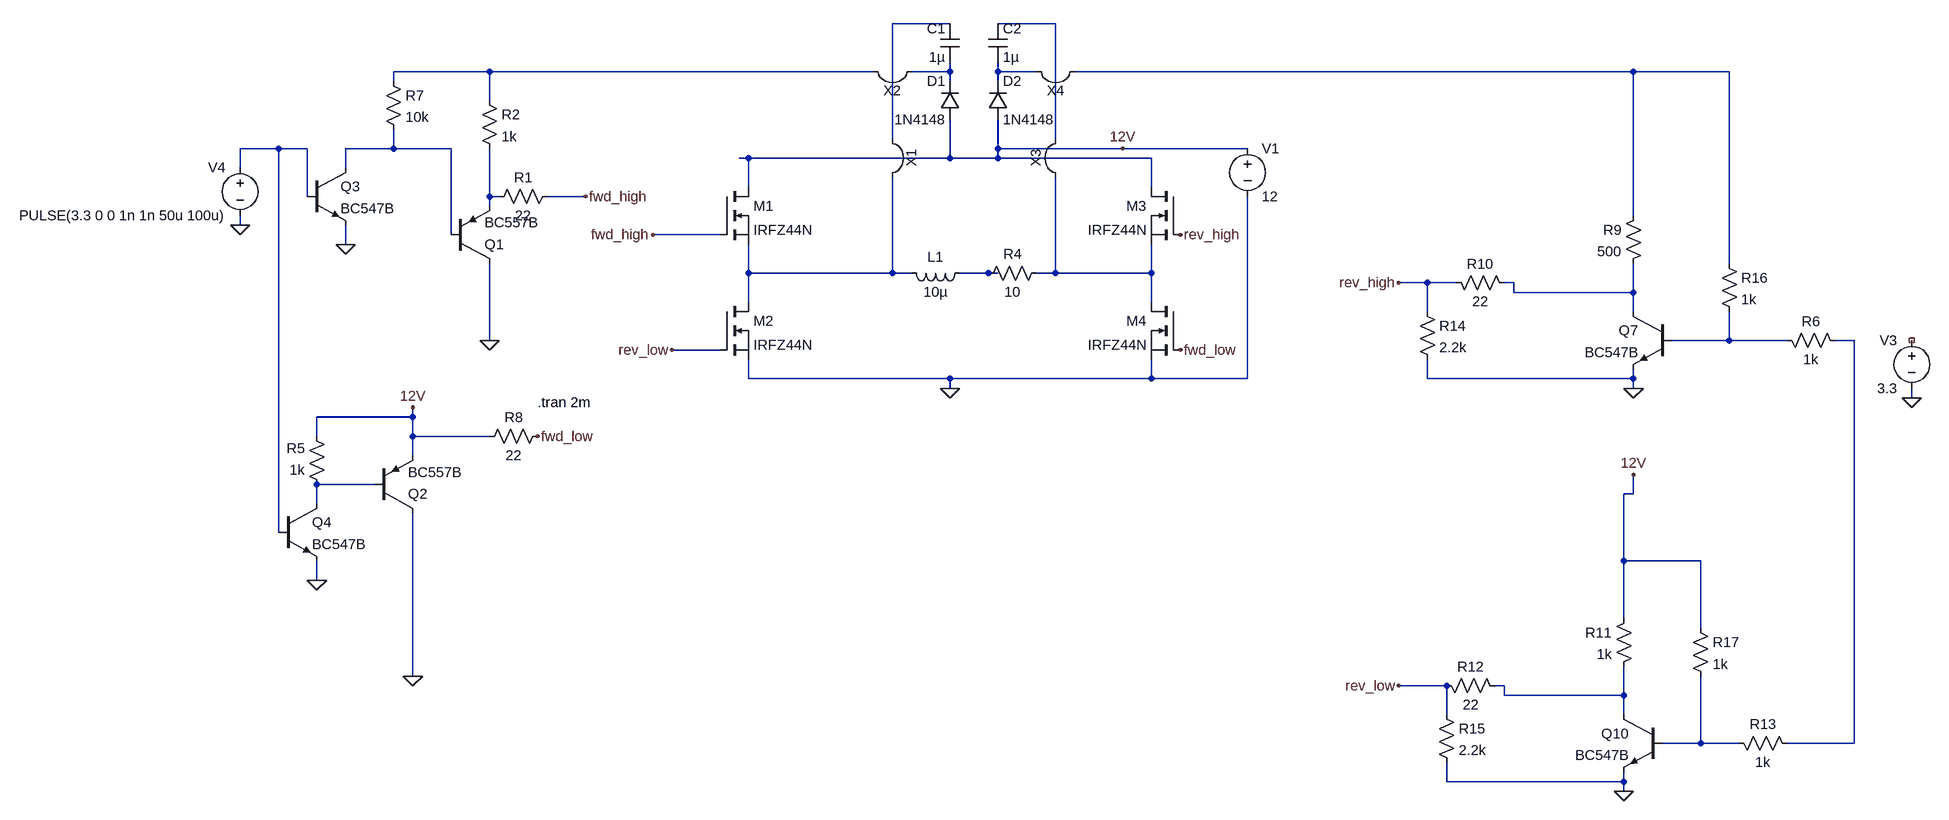
[diagram p0: schematic h-bridge-minimal-pnp-drive.asc]
h-bridge-minimal-pnp-drive.asc, the LTspice schematic file:
Version 4
SHEET 1 2020 1140
WIRE 224 -272 128 -272
WIRE 400 -272 304 -272
WIRE -672 -192 -832 -192
WIRE 96 -192 -672 -192
WIRE 224 -192 224 -208
WIRE 224 -192 160 -192
WIRE 304 -192 304 -208
WIRE 368 -192 304 -192
WIRE 1520 -192 432 -192
WIRE 1680 -192 1520 -192
WIRE -832 -176 -832 -192
WIRE 224 -176 224 -192
WIRE 304 -176 304 -192
WIRE -672 -144 -672 -192
WIRE 128 -80 128 -272
WIRE 400 -80 400 -272
WIRE -1024 -64 -1088 -64
WIRE -976 -64 -1024 -64
WIRE -832 -64 -832 -96
WIRE -832 -64 -912 -64
WIRE -736 -64 -832 -64
WIRE 304 -64 304 -112
WIRE 512 -64 304 -64
WIRE 720 -64 512 -64
WIRE -240 -48 -256 -48
WIRE 224 -48 224 -112
WIRE 224 -48 -240 -48
WIRE 304 -48 304 -64
WIRE 304 -48 224 -48
WIRE 560 -48 304 -48
WIRE -1088 -32 -1088 -64
WIRE -912 -32 -912 -64
WIRE -240 0 -240 -48
WIRE 560 0 560 -48
WIRE -976 16 -976 -64
WIRE -672 16 -672 -64
WIRE -656 16 -672 16
WIRE -512 16 -576 16
WIRE -672 32 -672 16
WIRE 1520 48 1520 -192
WIRE -1088 64 -1088 48
WIRE -736 80 -736 -64
WIRE -288 80 -400 80
WIRE -912 96 -912 64
WIRE 1680 128 1680 -192
WIRE -240 144 -240 96
WIRE 128 144 128 -16
WIRE 128 144 -240 144
WIRE 160 144 128 144
WIRE 288 144 240 144
WIRE 304 144 288 144
WIRE 400 144 400 -16
WIRE 400 144 368 144
WIRE 560 144 560 96
WIRE 560 144 400 144
WIRE 1120 160 1072 160
WIRE 1168 160 1120 160
WIRE 1264 160 1248 160
WIRE 1264 176 1264 160
WIRE 1520 176 1520 128
WIRE 1520 176 1264 176
WIRE -240 192 -240 144
WIRE 560 192 560 144
WIRE 1120 208 1120 160
WIRE 1520 208 1520 176
WIRE -672 256 -672 128
WIRE 1680 256 1680 208
WIRE 1680 256 1584 256
WIRE 1776 256 1680 256
WIRE 1888 256 1856 256
WIRE -288 272 -368 272
WIRE -240 320 -240 288
WIRE 224 320 -240 320
WIRE 560 320 560 288
WIRE 560 320 224 320
WIRE 720 320 720 16
WIRE 720 320 560 320
WIRE 1120 320 1120 288
WIRE 1520 320 1520 304
WIRE 1520 320 1120 320
WIRE 224 336 224 320
WIRE 1520 336 1520 320
WIRE 1984 352 1984 336
WIRE -800 384 -800 368
WIRE -800 384 -960 384
WIRE -960 416 -960 384
WIRE -800 416 -800 384
WIRE -672 416 -800 416
WIRE -800 448 -800 416
WIRE -864 496 -960 496
WIRE 1520 512 1520 480
WIRE 1520 512 1504 512
WIRE -960 528 -960 496
WIRE -1024 576 -1024 -64
WIRE 1504 624 1504 512
WIRE 1632 624 1504 624
WIRE -960 656 -960 624
WIRE 1504 720 1504 624
WIRE 1632 736 1632 624
WIRE -800 816 -800 544
WIRE 1152 832 1072 832
WIRE 1248 832 1232 832
WIRE 1248 848 1248 832
WIRE 1504 848 1504 800
WIRE 1504 848 1248 848
WIRE 1152 880 1152 832
WIRE 1504 880 1504 848
WIRE 1632 928 1632 816
WIRE 1632 928 1568 928
WIRE 1696 928 1632 928
WIRE 1888 928 1888 256
WIRE 1888 928 1776 928
WIRE 1152 992 1152 960
WIRE 1504 992 1504 976
WIRE 1504 992 1152 992
WIRE 1504 1008 1504 992
FLAG 224 336 0
FLAG 608 272 fwd_low
FLAG -592 416 fwd_low
FLAG 512 -64 12V
FLAG 1984 352 0
FLAG 1520 336 0
FLAG 1504 1008 0
FLAG 1072 832 rev_low
FLAG 1520 480 12V
FLAG 1072 160 rev_high
FLAG 608 80 rev_high
FLAG -368 272 rev_low
FLAG -400 80 fwd_high
FLAG -512 16 fwd_high
FLAG -1088 64 0
FLAG -672 256 0
FLAG -800 816 0
FLAG -800 368 12V
FLAG -912 96 0
FLAG -960 656 0
SYMBOL nmos -288 0 R0
SYMATTR InstName M1
SYMATTR Value IRFZ44N
SYMBOL nmos -288 192 R0
SYMATTR InstName M2
SYMATTR Value IRFZ44N
SYMBOL nmos 608 0 M0
SYMATTR InstName M3
SYMATTR Value IRFZ44N
SYMBOL nmos 608 192 M0
SYMATTR InstName M4
SYMATTR Value IRFZ44N
SYMBOL voltage 720 -80 R0
WINDOW 123 0 0 Left 0
WINDOW 39 0 0 Left 0
SYMATTR InstName V1
SYMATTR Value 12
SYMBOL diode 240 -112 R180
WINDOW 0 24 64 Left 2
WINDOW 3 24 0 Left 2
SYMATTR InstName D1
SYMATTR Value 1N4148
SYMBOL cap 240 -208 R180
WINDOW 0 24 56 Left 2
WINDOW 3 24 8 Left 2
SYMATTR InstName C1
SYMATTR Value 1µ
SYMBOL Misc\\jumper 192 -48 R90
SYMATTR InstName X1
SYMBOL Misc\\jumper 128 -128 R180
SYMATTR InstName X2
SYMBOL res 384 128 R90
WINDOW 0 0 56 VBottom 2
WINDOW 3 32 56 VTop 2
SYMATTR InstName R4
SYMATTR Value 10
SYMBOL res -576 400 R90
WINDOW 0 0 56 VBottom 2
WINDOW 3 32 56 VTop 2
SYMATTR InstName R8
SYMATTR Value 22
SYMBOL voltage 1984 240 M0
WINDOW 123 0 0 Left 0
WINDOW 39 0 0 Left 0
SYMATTR InstName V3
SYMATTR Value 3.3
SYMBOL res 1760 240 M90
WINDOW 0 0 56 VBottom 2
WINDOW 3 32 56 VTop 2
SYMATTR InstName R6
SYMATTR Value 1k
SYMBOL npn 1584 208 M0
SYMATTR InstName Q7
SYMATTR Value BC547B
SYMBOL res 1536 32 M0
SYMATTR InstName R9
SYMATTR Value 500
SYMBOL res 1152 144 M90
WINDOW 0 0 56 VBottom 2
WINDOW 3 32 56 VTop 2
SYMATTR InstName R10
SYMATTR Value 22
SYMBOL npn 1568 880 M0
SYMATTR InstName Q10
SYMATTR Value BC547B
SYMBOL res 1520 704 M0
SYMATTR InstName R11
SYMATTR Value 1k
SYMBOL res 1136 816 M90
WINDOW 0 0 56 VBottom 2
WINDOW 3 32 56 VTop 2
SYMATTR InstName R12
SYMATTR Value 22
SYMBOL res 1680 912 M90
WINDOW 0 0 56 VBottom 2
WINDOW 3 32 56 VTop 2
SYMATTR InstName R13
SYMATTR Value 1k
SYMBOL diode 288 -112 M180
WINDOW 0 24 64 Left 2
WINDOW 3 24 0 Left 2
SYMATTR InstName D2
SYMATTR Value 1N4148
SYMBOL cap 288 -208 M180
WINDOW 0 24 56 Left 2
WINDOW 3 24 8 Left 2
SYMATTR InstName C2
SYMATTR Value 1µ
SYMBOL Misc\\jumper 336 -48 M90
SYMATTR InstName X3
SYMBOL Misc\\jumper 400 -128 M180
SYMATTR InstName X4
SYMBOL ind 256 128 R90
WINDOW 0 5 56 VBottom 2
WINDOW 3 32 56 VTop 2
SYMATTR InstName L1
SYMATTR Value 10µ
SYMBOL res 1104 192 R0
SYMATTR InstName R14
SYMATTR Value 2.2k
SYMBOL res 1136 864 R0
SYMATTR InstName R15
SYMATTR Value 2.2k
SYMBOL res 1664 112 R0
SYMATTR InstName R16
SYMATTR Value 1k
SYMBOL res 1616 720 R0
SYMATTR InstName R17
SYMATTR Value 1k
SYMBOL pnp -736 128 M180
SYMATTR InstName Q1
SYMATTR Value BC557B
SYMBOL voltage -1088 -48 M0
WINDOW 123 0 0 Left 0
WINDOW 39 0 0 Left 0
SYMATTR InstName V4
SYMATTR Value PULSE(3.3 0 0 1n 1n 50u 100u)
SYMBOL pnp -864 544 M180
SYMATTR InstName Q2
SYMATTR Value BC557B
SYMBOL res -944 512 R180
WINDOW 0 36 76 Left 2
WINDOW 3 36 40 Left 2
SYMATTR InstName R5
SYMATTR Value 1k
SYMBOL res -848 -192 R0
SYMATTR InstName R7
SYMATTR Value 10k
SYMBOL npn -976 -32 R0
SYMATTR InstName Q3
SYMATTR Value BC547B
SYMBOL res -560 0 R90
WINDOW 0 0 56 VBottom 2
WINDOW 3 32 56 VTop 2
SYMATTR InstName R1
SYMATTR Value 22
SYMBOL npn -1024 528 R0
SYMATTR InstName Q4
SYMATTR Value BC547B
SYMBOL res -688 -160 R0
SYMATTR InstName R2
SYMATTR Value 1k
TEXT -592 360 Left 2 !.tran 2m

The netlist it stands for:
* h-bridge-minimal-pnp-drive.asc
M1 12V fwd_high N001 N001 IRFZ44N
M2 N001 rev_low 0 0 IRFZ44N
M3 12V rev_high N002 N002 IRFZ44N
M4 N002 fwd_low 0 0 IRFZ44N
V1 12V 0 12
D1 12V N003 1N4148
C1 N003 N001 1µ
R4 N002 N008 10
R8 fwd_low 12V 22
V3 NC_01 0 3.3
R6 N010 N011 1k
Q7 N009 N010 0 0 BC547B
R9 N004 N009 500
R10 rev_high N009 22
Q10 N013 N014 0 0 BC547B
R11 12V N013 1k
R12 rev_low N013 22
R13 N014 N011 1k
D2 12V N004 1N4148
C2 N004 N002 1µ
L1 N008 N001 10µ
R14 rev_high 0 2.2k
R15 rev_low 0 2.2k
R16 N004 N010 1k
R17 12V N014 1k
Q1 0 N006 N007 0 BC557B
V4 N005 0 PULSE(3.3 0 0 1n 1n 50u 100u)
Q2 0 N012 12V 0 BC557B
R5 N012 12V 1k
R7 N003 N006 10k
Q3 N006 N005 0 0 BC547B
R1 fwd_high N007 22
Q4 N012 N005 0 0 BC547B
R2 N003 N007 1k
.model D D
.lib standard.dio
.model NPN NPN
.model PNP PNP
.lib standard.bjt
.model NMOS NMOS
.model PMOS PMOS
.lib standard.mos
.tran 2m
.backanno
.end